# EAGLE design ATC_I2C_Disp (EAGLE 7.4.0)
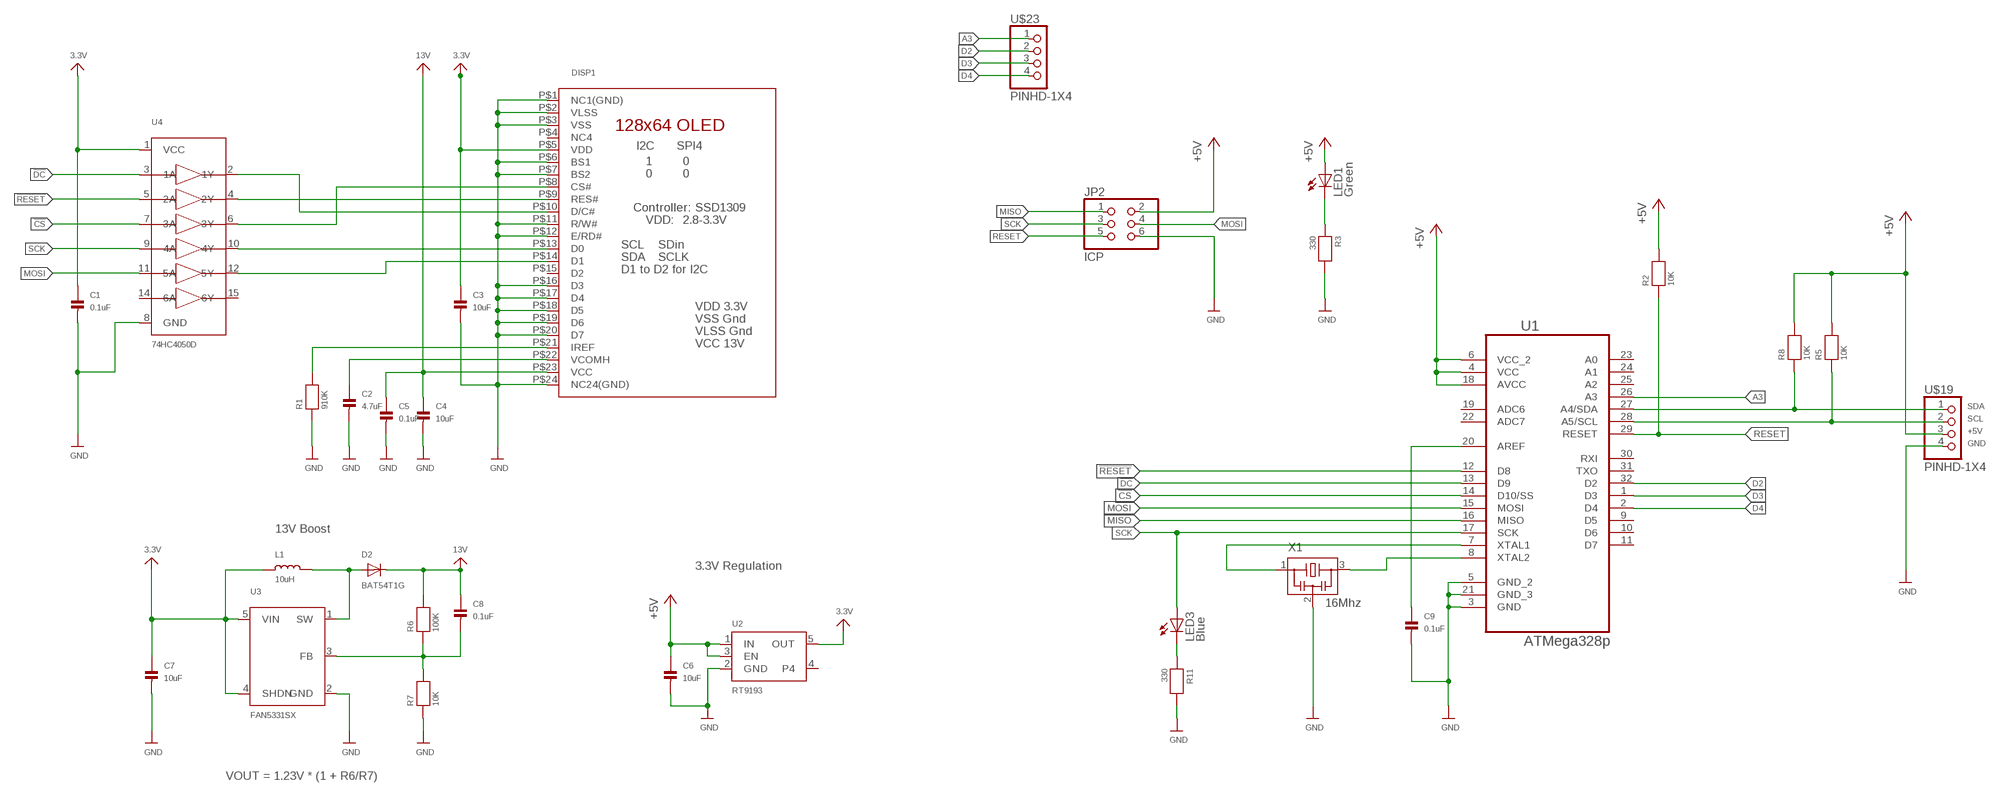
[diagram p0: schematic, sheet 1]

## Parts
C1  0.1uF  CAP_CERAMIC0805  [0805]
C2  4.7uF  CAP_CERAMIC0805  [0805]
C3  10uF  CAP_CERAMIC0805  [0805]
C4  10uF  CAP_CERAMIC0805  [0805]
C5  0.1uF  CAP_CERAMIC0805  [0805]
C6  10uF  CAP_CERAMIC0805  [0805]
C7  10uF  CAP_CERAMIC0805  [0805]
C8  0.1uF  CAP_CERAMIC0805  [0805]
C9  0.1uF  CAP_CERAMIC0805  [0805]
D2  BAT54T1G  DIODESOD-123  [SOD-123]
DISP1  1.5-128X64-OLED  [1.5-128X64-TOP-CONTACT]
JP2  ICP  PINHD-2X3  [2X03]
L1  10uH  INDUCTOR  [INDUCTOR_1007]
LED1  Green  LEDCHIPLED_0805  [CHIPLED_0805]
LED3  Blue  LEDCHIPLED_0805  [CHIPLED_0805]
R1  910K  RESISTOR0805  [0805]
R2  10K  RESISTOR0805  [0805]
R3  330  RESISTOR0805  [0805]
R5  10K  RESISTOR0805  [0805]
R6  100K  RESISTOR0805  [0805]
R7  10K  RESISTOR0805  [0805]
R8  10K  RESISTOR0805  [0805]
R11  330  RESISTOR0805  [0805]
U1  ATMega328p  ATMEGA328P-AU  [TQFP-32]
U2  RT9193  VREG_SOT23-5  [SOT23-5]
U3  FAN5331SX  FAN5331  [SOT23-5]
U4  74HC4050D  [SOIC16]
U$19  PINHD-1X4  [1X04-BIG]
U$23  PINHD-1X4  [1X04-BIG]
X1  16Mhz  CSTCE-CRYSTAL-OSC  [CSTCE-CRYSTAL-OSC]

## Nets
3.3V: C1.1 C3.1 C7.1 DISP1.P$5(VDD) L1.P$1 U2.5(OUT) U3.4(SHDN) U3.5(VIN) U4.1(VCC)
13V: C4.1 C5.1 C8.1 D2.C DISP1.P$23(VCC) R6.2
!CS: U1.14(D10/SS) U4.7(3A)
!DC: U1.13(D9) U4.3(1A)
!RESET: U1.12(D8) U4.5(2A)
+5V: C6.1 JP2.2 LED1.A R2.2 R5.2 R8.2 U1.4(VCC) U1.6(VCC_2) U1.18(AVCC) U2.1(IN) U2.3(EN) U$19.3
A3: U1.26(A3) U$23.1
CS: DISP1.P$8(CS#) U4.6(3Y)
D0: DISP1.P$13(D0) U4.10(4Y)
D1: DISP1.P$14(D1) U4.12(5Y)
D2: U1.32(D2) U$23.2
D3: U1.1(D3) U$23.3
D4: U1.2(D4) U$23.4
DC: DISP1.P$10(D/C#) U4.2(1Y)
GND: C1.2 C2.2 C3.2 C4.2 C5.2 C6.2 C7.2 C9.2 DISP1.P$1(NC1(GND)) DISP1.P$2(VLSS) DISP1.P$3(VSS) DISP1.P$6(BS1) DISP1.P$7(BS2) DISP1.P$11(R/W#) DISP1.P$12(E/RD#) DISP1.P$16(D3) DISP1.P$17(D4) DISP1.P$18(D5) DISP1.P$19(D6) DISP1.P$20(D7) DISP1.P$24(NC24(GND)) JP2.6 R1.1 R3.2 R7.1 R11.2 U1.3(GND) U1.5(GND_2) U1.21(GND_3) U2.2(GND) U3.2(GND) U4.8(GND) U$19.4 X1.2
MISO: JP2.1 U1.16(MISO)
MOSI: JP2.4 U1.15(MOSI) U4.11(5A)
N$1: LED1.C R3.1
N$5: D2.A L1.P$2 U3.1(SW)
N$6: U1.7(XTAL1) X1.1
N$7: DISP1.P$21(IREF) R1.2
N$8: C8.2 R6.1 R7.2 U3.3(FB)
N$9: C2.1 DISP1.P$22(VCOMH)
N$10: U1.8(XTAL2) X1.3
N$11: C9.1 U1.20(AREF)
N$19: LED3.C R11.1
RES: DISP1.P$9(RES#) U4.4(2Y)
RESET: JP2.5 R2.1 U1.29(RESET)
SCK: JP2.3 LED3.A U1.17(SCK) U4.9(4A)
SCL: R5.1 U1.28(A5/SCL) U$19.2
SDA: R8.1 U1.27(A4/SDA) U$19.1
Unconnected: DISP1.P$4(NC4) DISP1.P$15(D2) U1.9(D5) U1.10(D6) U1.11(D7) U1.19(ADC6) U1.22(ADC7) U1.23(A0) U1.24(A1) U1.25(A2) U1.30(RXI) U1.31(TXO) U2.4 U4.14(6A) U4.15(6Y)

## Notes on the sheet
- 13V Boost
- 3.3V Regulation
- VOUT = 1.23V * (1 + R6/R7)

## Library data of the parts
C1-C9 = microbuilder:CAP_CERAMIC: Ceramic Capacitors 0402 - 0402 Surface Mount Capacitors 16pF 50V 5% [Digikey: 445-4899-2-ND] 18pF 50V 5% [Digikey: 490-1281-2-ND] 22pF 50V 5% [Digikey: 490-1283-2-ND] 68pF 50V 5% [Digikey: 490-1289-2-ND] 0.1uF 10V 10% [Digikey: 490-1318-2-ND] 1.0uF 6.3V 10% [Digikey: 490-1320-2-ND] 0603 - 0603 Surface Mount Capacitors 16 pF 50V 5% [Digikey: 445-5051-2-ND] 22 pF 50V [Digikey: PCC220ACVTR-ND] 33 pF 50V 5% [Digikey: 490-1415-1-ND] 56pF 50V 5% [Digikey: 490-1421-1-ND] 220pF 50V 5% [Digikey: 445-1285-1-ND] 680 pF 50V 2200 pF 50V 5% C0G [Digikey: 445-1297-1-ND] 5600 pF 100V 5% X7R [Digikey: 478-3711-1-ND] 0.1 µF 25V 10% [Digikey: PCC2277TR-ND] 0.22 µF 16V 10% X7R [Digikey: 445-1318-1-ND] 1.0 µF 25V 10% [Digikey: 445-5146-2-ND] 0603 - RF Specific 3pF 250V +/-0.1pF RF [Digikey: 712-1347-1-ND] 18 pF 250V 5% [Digikey: 478-3505-1-ND or 712-1322-1-ND] 56 pF 250V 5% C0G RF [Digikey: 490-4867-1-ND] 68 pF 250V RF [Digikey: 490-4868-1-ND] 0805 - 0805 Surface Mount Capacitors 220 pF 250V 2% RF Ceramic Capacitor [Digikey: 712-1398-1-ND] 1000 pF 50V 2% NP0 Ceramic Capacitor [Digikey: 478-3760-1-ND] 0.1 µF 25V 10% Ceramic Capacitor [Digikey: PCC1828TR-ND] 1.0 µF 16V 10% Ceramic Capacitor[Digikey: 490-1691-2-ND] 10.0 µF 10V 10% Ceramic Capacitor[Digikey: 709-1228-1-ND] 10.0 uF 16V 10% Ceramic Capacitor [Digikey: 478-5165-2-ND] 47 uF 6.3V 20% Ceramic Capacitor [Digikey: 587-1779-1-ND or 399-5506-1-ND] 1206 - 1206 Surface Mount Capacitors 47uF 10V 20% Ceramic Capacitor [Digikey: 490-5528-1-ND or 399-5508-1-ND or 445-6010-1-ND] 100uF 6.3V -20%, +80% Y5V Ceramic Capacitor (Digikey: 490-4512-1-ND, Mouser: 81-GRM31CF50J107ZE1L)
D2 = microbuilder:DIODE: Diode SMA Model Volts Amps Type Vf Vr Digikey # Notes SSA34-E3 40V 3A Schottky 480mV @ 3A 200uA @ 40V SSA34-E3/61TGITR-ND CDBA120-G 20V 1A Schottky 500mV @ 1A 500uA @ 20V 641-1014-6-ND REEL MBRA210 10V 2A Schottky 350mV @ 2A 700uA @ 10V MBRA210LT3 SOD-123 Model Volts Amps Type Vf Vr Order # Notes BAT54T1G 30V 200mA Schottky 800mV @ 200mA 2uA @ 25V BAT54T1GOSTR-ND B0530W 30V 500mA Schottky 430mV @ 500mA 130uA @ 30V B0530W-FDICT-ND REEL MBR120 1A 20V Schottky 340mV @ 1A MBR120VLSFT1GOSCT-ND SOD-323 Model Volts Amps Type Vf Vr Order # Notes PMEG2005EJ 20V 500mA Schottky 355mV @ 500mA 568-4110-1-ND ZLLS410 10V 570mA Schottky 380mV @ 570mA ZLLS410CT-ND 1N4148WS 75V 150mA Silicon/Simple 1V 1N4148WSFSCT-ND REEL SOD-523 Model Volts Amps Type Vf Vr Order # Notes BAT54XV2 30V 200mA Schottky 0.8V @ 100mA BAT54XV2CT-ND TB751S 30V 30mA Schottky RB751S-40TE61CT-ND SOT23-R/W (R = Solder Paste/Reflow Ovens, W = Hand-Soldering) Model Volts Amps Type Vf Vr Order # Notes BAT54FILM 40V 300mA Schottky 497-7162-1-ND
DISP1 = Peters:1.5-128X64-OLED: 1.5" 128x64 OLED Display SSD1309 controller
JP2 = pinhead:PINHD-2X3: PIN HEADER
L1 = microbuilder:INDUCTOR: Inductors 0603: 10nH Ceramic Inductor - microwire antenna/RF (Digikey: 712-1434-2-ND) 0805: 560nH Ceramic Inductor - RF (Digikey: 553-1047-1-ND) 270nH Ceramic Inductor - Q = 40@250MHz, +-5%, 1 Ohm DC Resistance (Digikey: 535-10506-2-ND) 1007 (2518 Metric) SMT: 10µH 10% 250mOhm 820mA 1007 Inductor (Digikey: 587-2189-1-ND) 22µH 10% 500mOhm 580mA 1007 Inductor (Digikey: 587-2190-1-ND) 47µH 10% 950mOhm 420mA 1007 Inductor (Digikey: 587-2191-1-ND) 47µH 5% 100mOhm 1A 1008 Inductor (Digikey: 732-1816-1-ND) 5.0x5.0mm (Taiyo Yuden NR5040 Series) 6.8µH 20% 2.3A 64mOhm Inductor (Digikey: 587-2374-2-ND) 5.0x5.0mm (TDK VLC5045 Series) 4.7µH 20% 3.3A 34mOhm Inductor (Digikey: 445-6526-1-ND) 6.8µH 20% 2.7A 46mOhm Inductor (Digikey: 445-6527-1-ND) 6.0x6.0mm (TDK VLC6045 Series) 4.7µH 20% 3.8A 27mOhm Inductor (Digikey: 445-6538-2-ND) 6.8µH 20% 3A 41mOhm Inductor (Digikey: 445-6540-1-ND) 6.2µH 30% 2.2A 45mOhm Inductor (Digikey: SRR5028-6R2YCT-ND) - Not TDK VLC6045 but footprint should match 6.0x6.0mm (TDK SLF6045 Series) 6.8uH 30% 2A 33mOhm Inductor (Digikey: 445-4572-1-ND, Mouser: 810-SLF645T6R8N2R0PF)
LED1 LED3 = adafruit:LED: LED OSRAM: - CHIPLED LG R971, LG N971, LY N971, LG Q971, LY Q971, LO R971, LY R971 LH N974, LH R974 LS Q976, LO Q976, LY Q976 LO Q996 - Hyper CHIPLED LW Q18S LB Q993, LB Q99A, LB R99A - SideLED LS A670, LO A670, LY A670, LG A670, LP A670 LB A673, LV A673, LT A673, LW A673 LH A674 LY A675 LS A676, LA A676, LO A676, LY A676, LW A676 LS A679, LY A679, LG A679 - Hyper Micro SIDELED® LS Y876, LA Y876, LO Y876, LY Y876 LT Y87S - SmartLED LW L88C, LW L88S LB L89C, LB L89S, LG L890 LS L89K, LO L89K, LY L89K LS L896, LA L896, LO L896, LY L896 - TOPLED LS T670, LO T670, LY T670, LG T670, LP T670 LSG T670, LSP T670, LSY T670, LOP T670, LYG T670 LG T671, LOG T671, LSG T671 LB T673, LV T673, LT T673, LW T673 LH T674 LS T676, LA T676, LO T676, LY T676, LB T676, LH T676, LSB T676, LW T676 LB T67C, LV T67C, LT T67C, LS T67K, LO T67K, LY T67K, LW E67C LS E67B, LA E67B, LO E67B, LY E67B, LB E67C, LV E67C, LT E67C LW T67C LS T679, LY T679, LG T679 LS T770, LO T770, LY T770, LG T770, LP T770 LB T773, LV T773, LT T773, LW T773 LH T774 LS E675, LA E675, LY E675, LS T675 LS T776, LA T776, LO T776, LY T776, LB T776 LHGB T686 LT T68C, LB T68C - Hyper Mini TOPLED® LB M676 - Mini TOPLED Santana® LG M470 LS M47K, LO M47K, LY M47K Source: http://www.osram.convergy.de/
R1-R3 R5-R8 R11 = microbuilder:RESISTOR: Resistors 0402 - 0402 Surface Mount Package 22 Ohm 1% 1/16W [Digikey: 311-22.0LRTR-ND] 33 Ohm 5% 1/16W 1.0K 5% 1/16W 1.5K 5% 1/16W 2.0K 1% 1/16W 10.0K 1% 1/16W [Digikey: 311-10.0KLRTR-ND] 10.0K 5% 1/16W [Digikey: RMCF0402JT10K0TR-ND] 12.1K 1% 1/16W [Digikey: 311-22.0LRTR-ND] 100.0K 5% 1/16W 0603 - 0603 Surface Mount Package 0 Ohm 1/10 Watt 1% Resistor 15 Ohm 1/10 Watt 1% Resistor 33 Ohm 1/10 Watt 1% Resistor 49.9 Ohm 1/10 Watt 1% Resistor 100 Ohm 1/10 Watt 1% Resistor 150 Ohm 1/10 Watt 1% Resistor 240 Ohm 1/10 Watt 1% Resistor 390 Ohm 1/10 Watt 1% Resistor 560 Ohm 1/10 Watt 1% Resistor 680 Ohm 1/10 Watt 1% Resistor 750 Ohm 1/10 Watt 1% Resistor 1.0K Ohm 1/10 Watt 1% Resistor 1.5K Ohm 1/10 Watt 1% Resistor 2.0K Ohm 1/10 Watt 1% Resistor 2.2K Ohm 1/10 Watt 1% Resistor 3.3K Ohm 1/10 Watt 1% Resistor 4.7K Ohm 1/10 Watt 1% Resistor 10.0K Ohm 1/10 Watt 1% Resistor 12.0K Ohm 1/10 Watt 1% Resistor 12.1K Ohm 1/10 Watt 1% Resistor 20.0K Ohm 1/10 Watt 1% Resistor 33.0K Ohm 1/10 Watt 1% Resistor 100.0K Ohm 1/10 Watt 1% Resistor 0805 - 0805 Surface Mount Package 0 Ohm 1/8 Watt 1% Resistor 33 Ohm 1/8 Watt 1% Resistor 100 Ohm 1/8 Watt 1% Resistor 150 Ohm 1/8 Watt 1% Resistor 200 Ohm 1/8 Watt 1% Resistor 240 Ohm 1/8 Watt 1% Resistor 330 Ohm 1/8 Watt 1% Resistor 390 Ohm 1/8 Watt 1% Resistor 470 Ohm 1/8 Watt 1% Resistor 1.0K Ohm 1/8 Watt 1% Resistor 1.5K Ohm 1/8 Watt 1% Resistor 2.0K Ohm 1/8 Watt 1% Resistor 4.7K Ohm 1/8 Watt 1% Resistor 5.1K Ohm 1/8 Watt 1% Resistor 5.6K Ohm 1/8 Watt 1% Resistor 10.0K Ohm 1/8 Watt 1% Resistor 22.0K Ohm 1/8 Watt 1% Resistor 33.0K Ohm 1/8 Watt 1% Resistor 100K Ohm 1/8 Watt 1% Resistor 1206 - 1206 Surface Mount Package 2012 - 2010 Surface Mount Package 0.11 Ohm 1/2 Watt 1% Resistor - Digikey: RHM.11UCT-ND
U1 = Peters:ATMEGA328P-AU
U2 = microbuilder:VREG_SOT23-5: SOT23-5 Fixed Voltage Regulators To better organise some of the SOT23-5 fixed voltage regulators in this library, this new part was created. Part Current Out V Out V In V Dropout Digikey Part No. ADP121 150mA 3.3V 3.4-5.5V 0.09V @ 150mA ADP121-AUJZ33R7CT-ND ADP121 150mA 3.0V 3.1-5.5V 0.09V @ 150mA ADP121-AUJZ30R7CT-ND ADP122 300mA 3.3V 3.4-5.5V 0.085V @ 300mA ADP122AUJZ-3.3-R7CT-ND ADP1712 300mA 3.3V 3.5-5.5V 0.17V @ 300mA ADP1712AUJZ-3.3-R7TR-ND AP7311 (Low Cost) 150mA 3.3V 3.5-6V 0.15V @ 150mA AP7311-33WG-7DICT-ND LD39015M18R 150mA 1.8V 1.9V-5.5V 0.08V @ 100mA 497-6977-1-ND MCP1824T-3302E/OT 300mA 3.3V 3.5V-6V 0.2V @ 300mA MCP1824T-3302E/OTCT-ND MIC5205-2.5YM5 TR 150mA 2.5V 2.7-16V 0.165V @ 150mA 576-1257-2-ND MIC5205-3.0YM5 TR 150mA 3.0V 3.2V-16V 0.165V @ 150mA 576-1258-2-ND MIC5205-3.3YM5 TR 150mA 3.3V 3.5V-16V 0.165V @ 150mA 576-1259-2-ND TPS780330220 150mA 3.3V+2.2V 3.6-5.5V 250mV Max 296-23332-1-ND TDA3663/N1,135 100mA 3.3V 3.5-45V 0.18V @ 50mA 568-5343-1-ND
U3 = microbuilder:FAN5331: FAN5331 - LED/OLED 20V Boost Converter Digikey: FAN5331SXCT-ND
U4 = microbuilder:74HC4050D: 6-channel level shifter 74HC4050D - 2V-6V Supply Digikey: 74HC4050D,653-ND Mouser: 771-74HC4050D-T
U$19 U$23 = adafruit:PINHD-1X4
X1 = Peters:CSTCE-CRYSTAL-OSC: Murata CSTCE series Ceramic Resonator

## Board
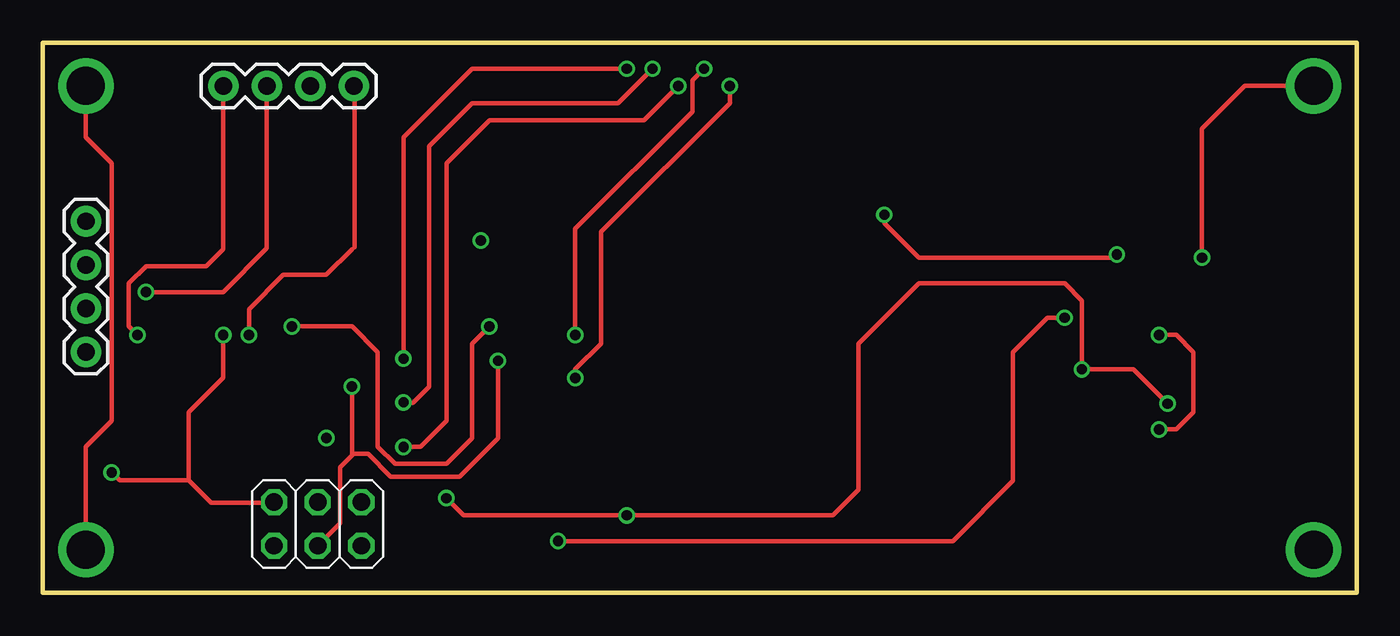
[diagram p1: board, top side]
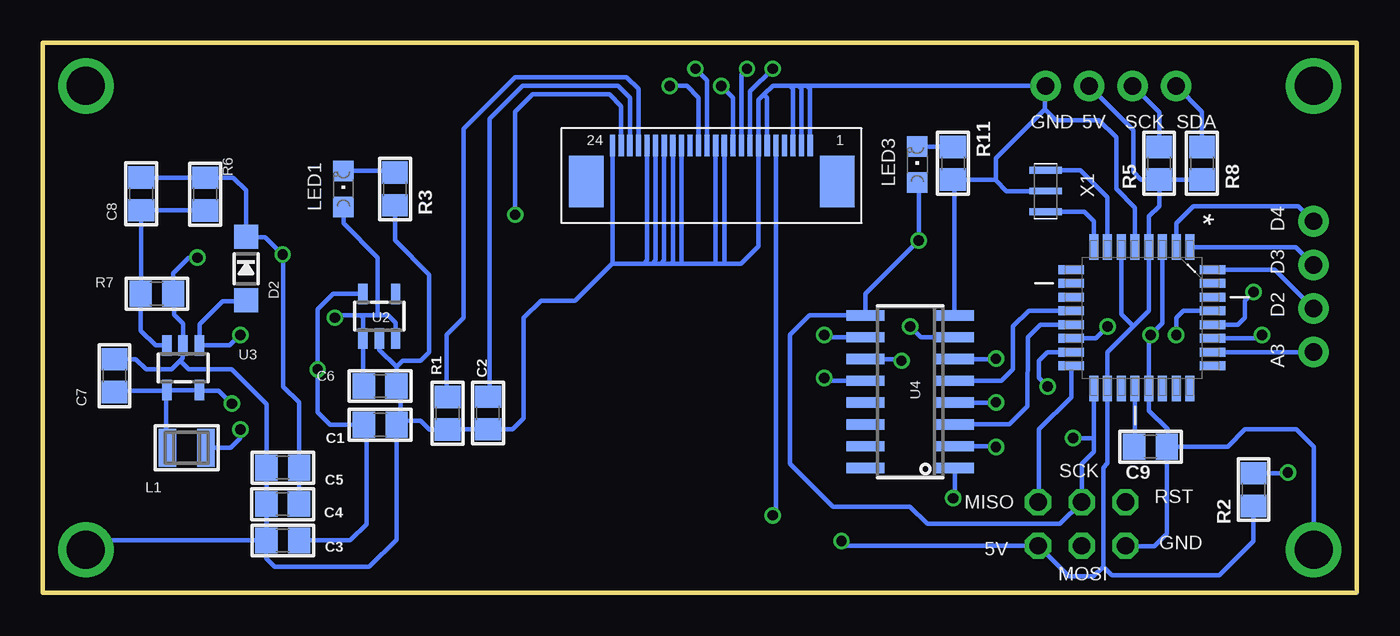
[diagram p2: board, bottom side, seen from below]

Size 76.5 x 32 mm. Coordinates in mm from the lower left corner, seen from the top.
Outline: 0,0 76.5,0 76.5,32 0,32 0,0
Copper layers (1*16): Top 0.0356mm / dielectric 1.5011mm / Bottom 0.0356mm
Design rules "LaenPCBOrder *": minimum track width 6mil, minimum drill 13mil, track to track 6mil, track to pad 6mil, pad to pad 6mil, via to via 6mil, smd to smd 6mil, copper to edge 15mil, drill to drill 6mil, minimum pad ring 7mil, minimum via ring 7mil, stop-mask expansion 3mil, vias tented up to drill 0mil, thermal gap 10mil
bRestrict: area 45,46.8 to 45.2,47.3; area 46,47.6 to 46.5,47.8

### Footprints (pad centres in the part's own frame; a part is rotated, then mirrored left to right if it is on the bottom)
0805 = smd 1.3 x 1.5: 1 -0.95,0; 2 0.95,0
SOD-123 = smd 1.4 x 1.4: A 1.85,0; C -1.85,0
1.5-128X64-TOP-CONTACT = smd 0.3 x 1.25: P$1 11.5,0; P$2 11,0; P$3 10.5,0; P$4 10,0; P$5 9.5,0; P$6 9,0; P$7 8.5,0; P$8 8,0; P$9 7.5,0; P$10 7,0; P$11 6.5,0; P$12 6,0; P$13 5.5,0; P$14 5,0; P$15 4.5,0; P$16 4,0; P$17 3.5,0; P$18 3,0; P$19 2.5,0; P$20 2,0; P$21 1.5,0; P$22 1,0; P$23 0.5,0; P$24 0,0 | smd 2 x 3: P$25 -1.54,-2.1; P$26 13.08,-2.1
2X03 = drill 1.016 octagon: 1 -2.54,-1.27; 2 -2.54,1.27; 3 0,-1.27; 4 0,1.27; 5 2.54,-1.27; 6 2.54,1.27
INDUCTOR_1007 = smd 1.016 x 2.2: P$1 -1.127,0; P$2 1.127,0
CHIPLED_0805 = smd 1.2 x 1.2: A 0,-1.05; C 0,1.05
TQFP-32 = smd 1.473 x 0.508: 1 -4.115,2.794; 2 -4.115,2.007; 3 -4.115,1.194; 4 -4.115,0.406; 5 -4.115,-0.406; 6 -4.115,-1.194; 7 -4.115,-2.007; 8 -4.115,-2.794; 17 4.115,-2.794; 18 4.115,-2.007; 19 4.115,-1.194; 20 4.115,-0.406; 21 4.115,0.406; 22 4.115,1.194; 23 4.115,2.007; 24 4.115,2.794 | smd 0.508 x 1.473: 9 -2.794,-4.115; 10 -2.007,-4.115; 11 -1.194,-4.115; 12 -0.406,-4.115; 13 0.406,-4.115; 14 1.194,-4.115; 15 2.007,-4.115; 16 2.794,-4.115; 25 2.794,4.115; 26 2.007,4.115; 27 1.194,4.115; 28 0.406,4.115; 29 -0.406,4.115; 30 -1.194,4.115; 31 -2.007,4.115; 32 -2.794,4.115
SOT23-5 = smd 0.55 x 1.2: 1 -0.95,-1.3; 2 0,-1.3; 3 0.95,-1.3; 4 0.95,1.3; 5 -0.95,1.3
SOIC16 = smd 0.6 x 2.2: 1 -4.445,-2.6; 2 -3.175,-2.6; 3 -1.905,-2.6; 4 -0.635,-2.6; 5 0.635,-2.6; 6 1.905,-2.6; 7 3.175,-2.6; 8 4.445,-2.6; 9 4.445,2.6; 10 3.175,2.6; 11 1.905,2.6; 12 0.635,2.6; 13 -0.635,2.6; 14 -1.905,2.6; 15 -3.175,2.6; 16 -4.445,2.6
1X04-BIG = drill 1.016 pad 1.778: 1 0,0; 2 2.54,0; 3 5.08,0; 4 7.62,0
CSTCE-CRYSTAL-OSC = smd 0.4 x 1.9: 1 -1.2,0; 2 0,0; 3 1.2,0

### Placement (x,y rotation side)
C1  56.86,9.77 0 bottom
C2  50.58,10.46 270 bottom
C3  62.53,3.04 180 bottom
C4  62.53,5.16 180 bottom
C5  62.53,7.28 180 bottom
C6  56.86,12.03 0 bottom
C7  72.33,12.63 90 bottom
C8  70.78,23.21 270 bottom
C9  12,8.5 0 bottom
D2  64.68,18.86 270 bottom
DISP1  43.32,26.03 0 bottom
JP2  16,4 180 top
L1  68.14,8.43 0 bottom
LED1  59,23.5 0 bottom
LED3  25.58,24.92 0 bottom
R1  52.94,10.44 90 bottom
R2  6,6 270 bottom
R3  56,23.5 270 bottom
R5  11.5,25 270 bottom
R6  67.05,23.2 90 bottom
R7  69.86,17.4 180 bottom
R8  9,25 270 bottom
R11  23.5,25 270 bottom
U1  12.5,16 270 bottom
U2  56.91,16.09 0 bottom
U3  68.33,13.09 180 bottom
U4  26,11.7 90 bottom
U$19  10.5,29.5 0 top
U$23  2.5,14 90 top
X1  18.1,23.38 270 bottom

### Tracks (layer width: path | path; a pad name or v marks a point on that pad's centre or on a via)
3.3V  (via drill 0.6)
  Top 0.254: v65.5,11 63.5,13 v60.5,13 60.5,17 59.5,18 51,18 47.5,14.5 47.5,6 46,4.5 v34,4.5 24.5,4.5 v23.5,5.5
  Bottom 0.254: 69.33,11.74 U3.4 U3.5 67.36,11.76 66.26,11.76 v65.5,11 | 69.33,11.74 69.33,8.5 L1.P$1 | 69.33,11.74 72.28,11.74 C7.1 72.39,11.74 | U2.5 59.6,17.39 60.5,16.5 v60.5,13 60.5,10.5 59.77,9.77 C1.1 57.66,9.63 57.66,3.98 58.6,3.04 C3.1 | DISP1.P$5 33.82,4.68 v34,4.5 | U4.1 23.4,5.6 v23.5,5.5
13V  (via drill 0.6)
  Top 0.254: v49,22 49,21.5 51,19.5 62.36,19.5 v62.54,19.68
  Bottom 0.254: C8.1 67.07,24.16 R6.2 65.42,24.16 64.68,23.42 D2.C 64.67,20.7 63.56,20.7 v62.54,19.68 62.5,19.64 62.5,12 61.58,11.08 C5.1 C4.1 | DISP1.P$23 42.82,28.32 43.5,29 48,29 49,28 v49,22
!CS  (via drill 0.6)
  Top 0.254: v26,15.5 25,14.5 25,9 23.5,7.5 20.5,7.5 19.5,8.5 19.5,14 18,15.5 v14.5,15.5
  Bottom 0.254: U1.14 15.19,14.81 v14.5,15.5 | U4.7 25.37,14.87 v26,15.5
!DC
  Bottom 0.254: U4.3 20.21,9.79 19.16,10.84 19.14,14.86 18.41,15.59 U1.13
!RESET
  Bottom 0.254: U4.5 20.67,12.33 20,13 20,15.5 19.09,16.41 U1.12
+5V  (via drill 0.6)
  Top 0.254: v59.5,16 58.5,16 56.5,14 56.5,6.5 53,3 v30,3
  Bottom 0.254: U2.3 55.96,15.7 56.4,16.14 57,16.14 | U2.1 | U2.1 57.86,12.08 C6.1 | 57,16.14 57,19.5 59,21.5 LED1.A | 57,16.14 58,16.14 | 58,16.14 59.36,16.14 v59.5,16 | U2.1 57.86,16 58,16.14 | R8.2 R5.2 | R5.2 11.5,22.5 12.09,21.91 U1.4 12.09,16.41 13,15.5 | 13,15.5 14.5,14 U1.18 14.51,7.53 14.76,7.28 14.76,1.52 | U1.6 13.69,16.19 13,15.5 | R5.2 12.55,24.05 13,24.5 13,26.92 U$19.3 | 14.76,1.52 15.34,0.94 16.75,0.94 JP2.2 29.73,2.73 v30,3 29.95,3.05 | R2.2 6,3 8,1 14.24,1 14.76,1.52
A3
  Bottom 0.254: U1.26 U$23.1
CS  (via drill 0.6)
  Top 0.254: v21,13.62 21,26.5 25,30.5 v34,30.5
  Bottom 0.254: DISP1.P$8 35.32,29.18 v34,30.5 | U4.6 21.02,13.6 v21,13.62
D0  (via drill 0.6)
  Top 0.254: v31,15 31,21.18 37.82,28 37.82,29.82 v38.5,30.5
  Bottom 0.254: DISP1.P$13 37.82,29.82 v38.5,30.5 | U4.10 30.87,14.87 v31,15
D1  (via drill 0.6)
  Top 0.254: v31,12.5 31,13 32.5,14.5 32.5,21 40,28.5 v40,29.5
  Bottom 0.254: 38.32,25.82 DISP1.P$14 38.32,28.82 39,29.5 v40,29.5 | 28.59,12.34 U4.12 30.84,12.34 v31,12.5
D2
  Bottom 0.254: U1.32 4.75,18.79 U$23.2
D3
  Bottom 0.254: U1.1 3.54,20.11 U$23.3
D4
  Bottom 0.254: U1.2 10.49,21.51 9.5,22.5 3.38,22.5 U$23.4
DC  (via drill 0.6)
  Top 0.254: v21,8.48 21.98,8.48 23.5,10 23.5,25 26,27.5 35,27.5 v37,29.5
  Bottom 0.254: DISP1.P$10 36.32,28.82 v37,29.5 | U4.2 21.04,8.52 v21,8.48
GND  (via drill 0.6, 2.2)
  Top 0.254: v74,29.5 70,29.5 67.5,27 v67.5,19.5 | v12,15 12,16.5 14,18.5 16.5,18.5 18,20 18.02,20 18.14,20.12 18.14,29.48 U$19.4 | v2.5,29.5 2.5,26.5 4,25 4,10 2.5,8.5 v2.5,2.5
  Bottom 0.254: DISP1.P$7 34.82,25.68 | v67.5,19.5 68,19.5 68.91,18.59 R7.1 68.86,17.35 68.86,16.18 68.33,15.65 U3.2 68.36,14.36 68.36,13.64 68.5,13.5 | 31.82,26.32 DISP1.P$1 31.82,29.32 32,29.5 | DISP1.P$24 43.32,19.18 | 43.32,19.18 45.5,17 47.5,17 48.5,16 48.5,10.16 49.14,9.52 C2.2 52.92,9.51 R1.1 53.99,9.49 54.5,10 55.68,10 | 43.3,19.2 43.32,19.18 | 40.5,19.16 41,19.16 | DISP1.P$19 40.82,19.34 41,19.16 | DISP1.P$18 40.32,19.34 40.5,19.16 | DISP1.P$12 37.32,19.2 37.36,19.16 | DISP1.P$7 34.82,20.18 35.84,19.16 36.9,19.16 | 55.68,10 C1.2 55.91,3.09 57.5,1.5 63,1.5 63.5,2 63.5,3.01 C3.2 | 55.68,10 55.68,11.8 C6.2 55.9,13.14 | 55.9,13.14 55.54,13.5 54.5,13.5 54,14 54,18.5 56,20.5 R3.2 | U2.2 56.91,14.15 55.9,13.14 | DISP1.P$2 32.32,29.32 32.5,29.5 | DISP1.P$3 32.82,29.32 33,29.5 | U4.8 23.42,16.16 23.42,23.97 R11.2 21.05,24.05 21,24 | 40.5,19.16 39.92,19.16 | 39.92,19.16 39.26,19.16 | 39.26,19.16 37.36,19.16 | 37.36,19.16 36.9,19.16 | DISP1.P$11 36.82,19.24 36.9,19.16 | DISP1.P$16 39.32,19.22 39.26,19.16 | DISP1.P$17 39.82,19.26 39.92,19.16 | 41,19.16 41.5,19.16 | 41.5,19.16 43.3,19.16 43.32,19.18 | DISP1.P$20 41.32,19.34 41.5,19.16 | DISP1.P$7 34.82,28.68 34.5,29 | 34.5,29 34,29.5 33,29.5 | DISP1.P$6 34.32,28.82 34.5,29 | C7.2 71.08,13.58 70.5,13 69,13 68.5,13.5 | C3.2 C4.2 C5.2 63.48,10.98 65.5,13 68,13 68.5,13.5 | C3.2 73.46,3.04 v74,2.5 | 2.55,2.55 v2.5,2.5 2.5,8.5 3.5,9.5 6.5,9.5 7.5,8.5 C9.2 | U1.3 11.31,15.69 v12,15 12.09,14.91 U1.21 12.09,10.59 11,9.5 11,8.55 C9.2 | U1.5 12.91,22.41 14,23.5 14,26.5 15,27.5 17.5,27.5 18.14,28.14 | X1.2 20.38,23.38 21,24 | 21,24 21,25.28 18.14,28.14 | 32,29.5 U$19.4 18.14,29.48 18.14,28.14
  Bottom 0.254: 32,29.5 32.5,29.5 | 32.5,29.5 33,29.5 | C9.2 11.05,3.43 11.78,2.7 13.43,2.7 JP2.6
MISO
  Bottom 0.254: U1.16 16.61,11.38 18.5,9.5 18.5,5.31 JP2.1
MOSI  (via drill 0.6)
  Top 0.254: v18,12 18,8 | 18,8 17.3,7.3 17.3,4.03 JP2.4 | v26.5,13.5 26.5,9 24.26,6.76 20.26,6.76 18.94,8.08 18.08,8.08 18,8
  Bottom 0.254: U1.15 18.01,13.99 18.5,13.5 18.5,12.5 v18,12 | U4.11 26.6,13.6 v26.5,13.5
N$1
  Bottom 0.254: LED1.C 56.1,24.55 R3.1
N$5  (via drill 0.6)
  Top 0.254: v65,9.5 66,9.5 67,10.5 67,14 66,15 v65,15
  Bottom 0.254: D2.A 64.72,16.96 66.04,16.96 67.39,15.62 U3.1 65.61,14.39 v65,15 | L1.P$2 65.57,8.43 65,9 v65,9.5
N$6
  Bottom 0.254: U1.7 14.51,23.01 16.08,24.58 X1.1
N$7
  Bottom 0.254: 52.92,11.41 R1.2 53,11.46 53,15 52,16 52,27 49,30 42.5,30 41.82,29.32 DISP1.P$21
N$8
  Bottom 0.254: R6.1 67.07,22.26 C8.2 70.78,17.43 R7.2 70.82,15.26 69.95,14.39 U3.3
N$9
  Bottom 0.254: 50.72,11.54 C2.1 50.5,11.49 50.48,26.38 50.48,27.58 48.56,29.5 43,29.5 42.32,28.82 DISP1.P$22
N$10
  Bottom 0.254: U1.8 15.29,21.61 15.86,22.18 X1.3
N$11
  Bottom 0.254: U1.20 12.91,8.54 C9.1
N$19
  Bottom 0.254: R11.1 25.56,25.95 LED3.C
RES  (via drill 0.6)
  Top 0.254: v35.5,30.5 33.5,28.5 25,28.5 22.5,26 22.5,12 21.56,11.06 21.02,11.06 v21,11.08
  Bottom 0.254: DISP1.P$9 35.82,30.18 v35.5,30.5 | U4.4 21.02,11.06 v21,11.08
RESET  (via drill 0.6)
  Top 0.254: v10.5,15 10.5,12.5 8.5,10.5 8.5,6.54 | 8.5,6.54 9.8,5.24 13.43,5.24 JP2.5 | 8.5,6.54 4.46,6.54 v4,7
  Bottom 0.254: U1.29 10.09,16.41 10.5,16 v10.5,15 | R2.1 4.05,6.95 v4,7
SCK  (via drill 0.6)
  Bottom 0.254: LED3.A 25.5,23.79 v25.5,20.5 28.6,17.4 U4.9 31.86,16.14 33,15 33,7.5 30.5,5 26,5 25,4 17.27,4 JP2.3 16,7.5 15.29,8.21 15.29,9 | U1.17 15.29,9 | v16.5,9 15.29,9
SCL  (via drill 0.6)
  Top 0.254: v6,17.5 10.5,17.5 13.04,20.04 U$19.2
  Bottom 0.254: R5.1 11.5,27.96 U$19.2 | U1.28 6.91,15.59 6.5,16 6.5,17 v6,17.5
SDA  (via drill 0.6)
  Top 0.254: v5.5,15 5,15.5 5,18 6,19 9.5,19 10.5,20 U$19.1
  Bottom 0.254: R8.1 9,28 U$19.1 | U1.27 5.69,14.81 v5.5,15

### Text on the board
bNames: SDA | SCK | 5V | GND | D4 | D3 | D2 | A3 | SCK | RST | MISO | GND | MOSI | 5V